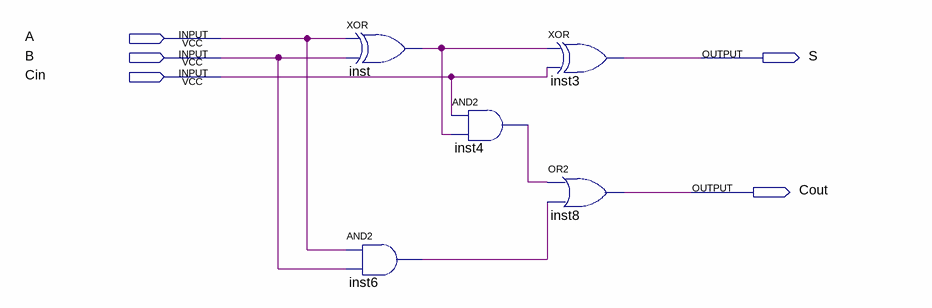
[diagram p0: schematic sheet]
// Quartus schematic FullAdder.bdf as structural Verilog: 5 symbols, 5 pins
module FullAdder (
  input  A,
  input  B,
  input  Cin,
  output S,
  output Cout
);

  wire inst4_out, inst6_out, inst_out;

  xor inst (inst_out, A, B);
  and inst6 (inst6_out, A, B);
  and inst4 (inst4_out, Cin, inst_out);
  xor inst3 (S, inst_out, Cin);
  or inst8 (Cout, inst4_out, inst6_out);
endmodule
